# Altium project PCB_Project.PrjPcb (part 1 of 2)
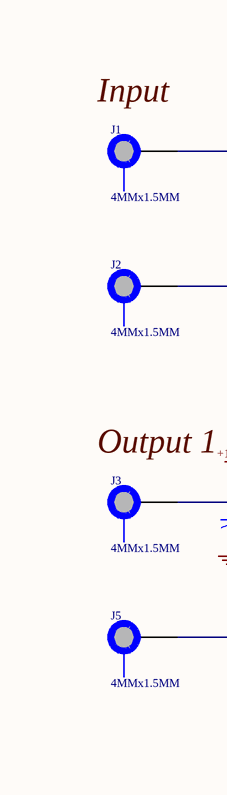
[diagram p0: ISL6236A_DEMO.SchDoc, left]
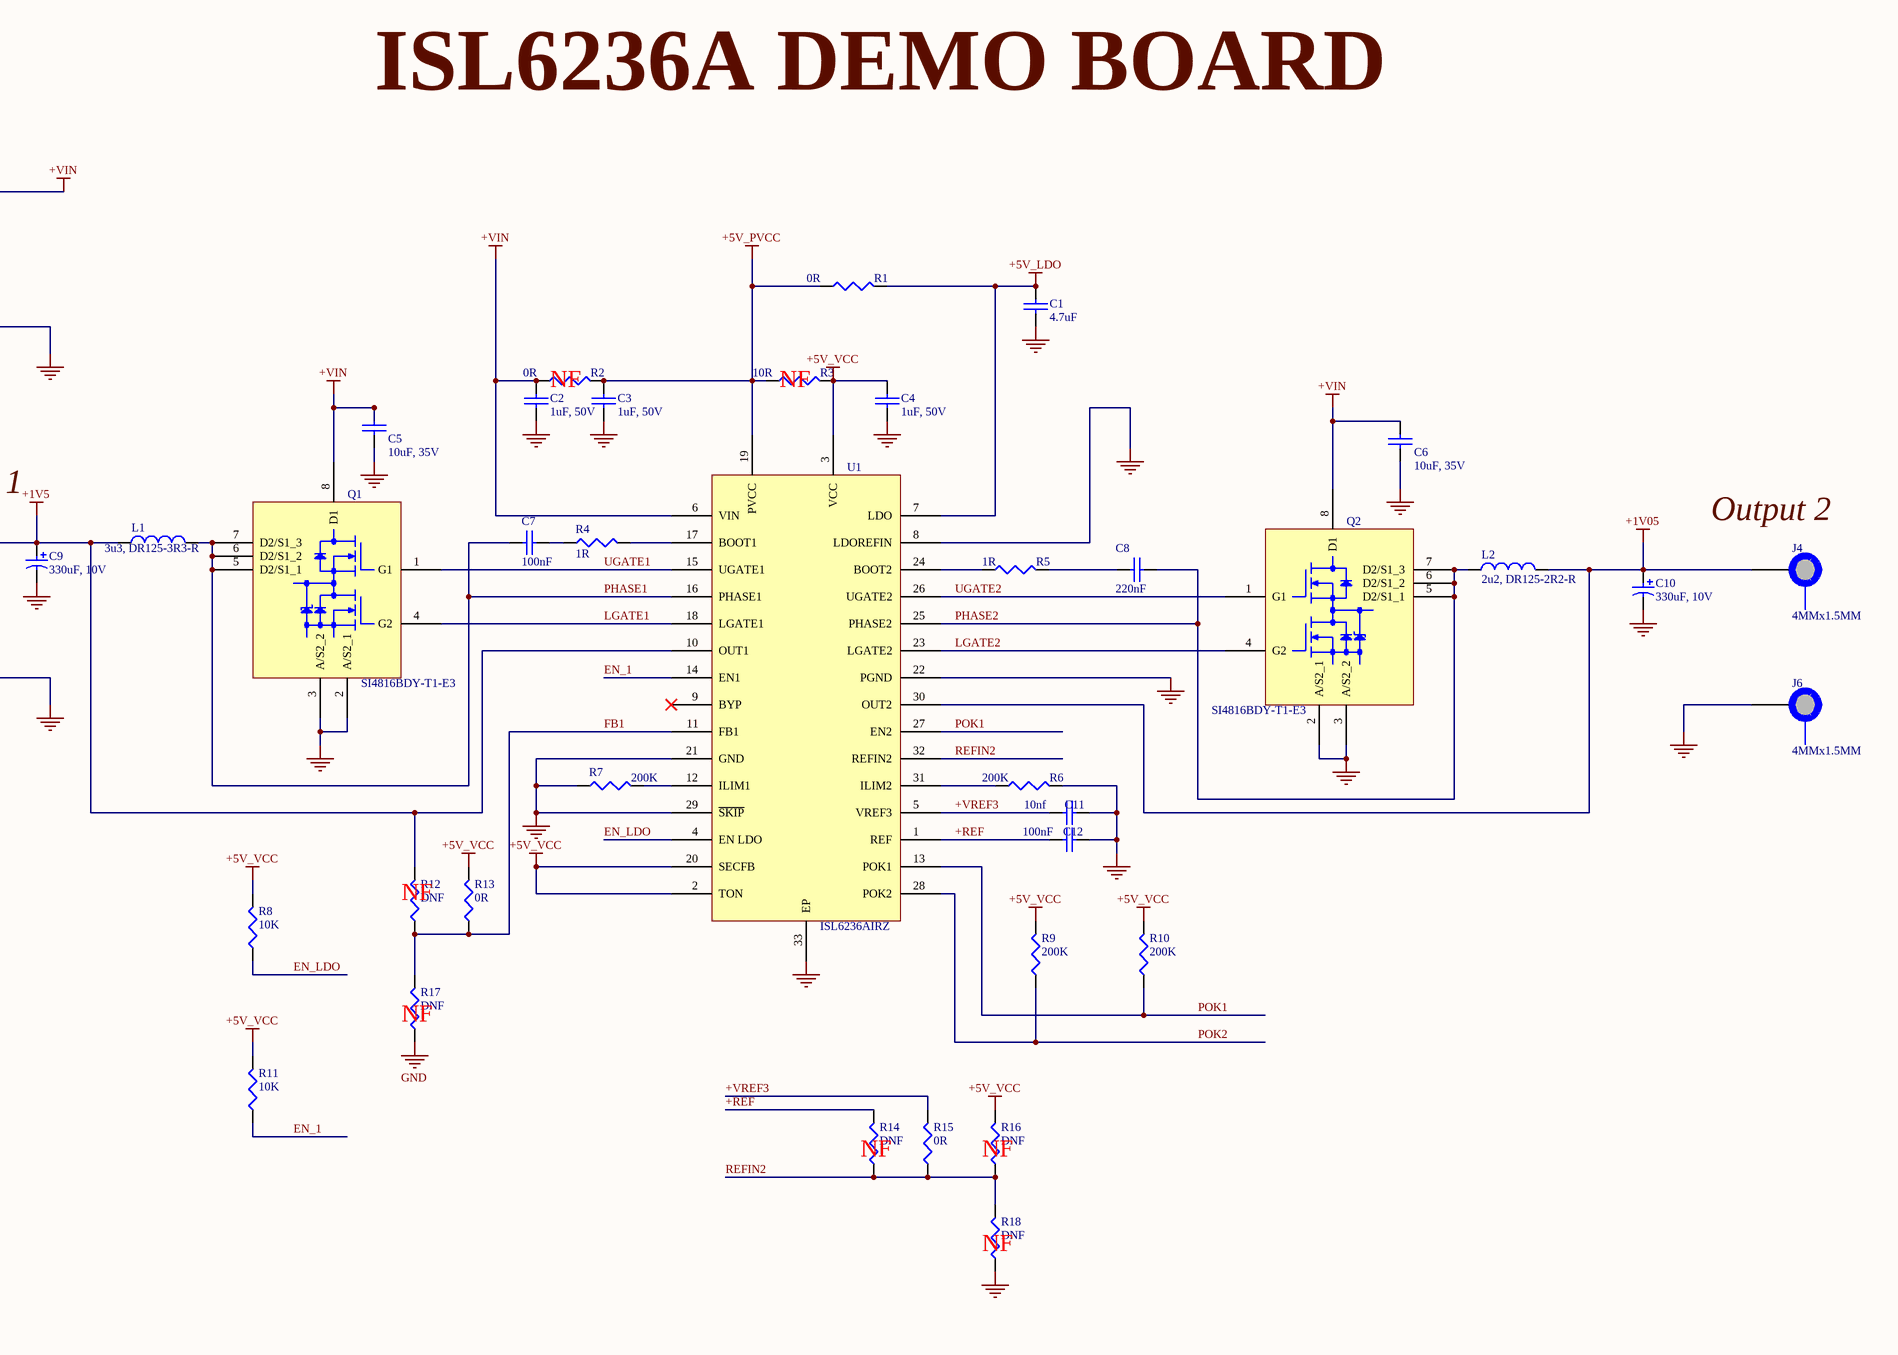
[diagram p1: ISL6236A_DEMO.SchDoc, right]
1 sheet, 41 parts. Net scope: global (net labels, ports and power ports of the same name join across sheets).

## Sheet ISL6236A_DEMO.SchDoc
size A3; SheetNumber: 1; SheetTotal: 1

### Parts
C1  4.7uF
C2  1uF, 50V
C3  1uF, 50V
C4  1uF, 50V
C5  10uF, 35V
C6  10uF, 35V
C7  100nF
C8  220nF
C9  330uF, 10V
C10  330uF, 10V
C11  10nf
C12  100nF
J1  4MMx1.5MM
J2  4MMx1.5MM
J3  4MMx1.5MM
J4  4MMx1.5MM
J5  4MMx1.5MM
J6  4MMx1.5MM
L1  3u3, DR125-3R3-R
L2  2u2, DR125-2R2-R
Q1  SI4816BDY-T1-E3
Q2  SI4816BDY-T1-E3
R1  0R
R2  0R
R3  10R
R4  1R
R5  1R
R6  200K
R7  200K
R8  10K
R9  200K
R10  200K
R11  10K
R12  DNF
R13  0R
R14  DNF
R15  0R
R16  DNF
R17  DNF
R18  DNF
U1  ISL6236AIRZ

### Nets
+1V05: C10.1 J4.1 L2.2 U1.30(OUT2)
+1V5: C9.1 J3.1 L1.1 R12.2 U1.10(OUT1)
+5V_LDO: C1.2 R1.2 U1.7(LDO)
+5V_PVCC: C3.1 R1.1 R2.2 R3.1 U1.19(PVCC)
+5V_VCC: C4.1 R3.2 R8.2 R9.2 R10.2 R11.2 R13.2 R16.2 U1.2(TON) U1.3(VCC) U1.20(SECFB)
+VIN: C2.1 C5.2 C6.2 J1.1 Q1.8(D1) Q2.8(D1) R2.1 U1.6(VIN)
GND: C1.1 C2.2 C3.2 C4.2 C5.1 C6.1 C9.2 C10.2 C11.2 C12.2 J2.1 J5.1 J6.1 Q1.2(A/S2_1) Q1.3(A/S2_2) Q2.2(A/S2_1) Q2.3(A/S2_2) R6.2 R7.1 R17.1 R18.1 U1.8(LDOREFIN) U1.21(GND) U1.22(PGND) U1.29(~{SKIP}) U1.33(EP)
+REF: C12.1 R14.2 U1.1(REF)
+VREF3: C11.1 R15.2 U1.5(VREF3)
EN_1: R11.1 U1.14(EN1)
EN_LDO: R8.1 U1.4(EN_LDO)
FB1: R12.1 R13.1 R17.2 U1.11(FB1)
LGATE1: Q1.4(G2) U1.18(LGATE1)
LGATE2: Q2.4(G2) U1.23(LGATE2)
PHASE1: C7.1 L1.2 Q1.5(D2/S1_1) Q1.6(D2/S1_2) Q1.7(D2/S1_3) U1.16(PHASE1)
PHASE2: C8.2 L2.1 Q2.5(D2/S1_1) Q2.6(D2/S1_2) Q2.7(D2/S1_3) U1.25(PHASE2)
POK1: R10.1 U1.13(POK1) U1.27(EN2)
POK2: R9.1 U1.28(POK2)
REFIN2: R14.1 R15.1 R16.1 R18.2 U1.32(REFIN2)
UGATE1: Q1.1(G1) U1.15(UGATE1)
UGATE2: Q2.1(G1) U1.26(UGATE2)
NetC7_2: C7.2 R4.1
NetC8_1: C8.1 R5.2
NetR4_2: R4.2 U1.17(BOOT1)
NetR5_1: R5.1 U1.24(BOOT2)
NetR6_1: R6.1 U1.31(ILIM2)
NetR7_2: R7.2 U1.12(ILIM1)

Not connected (* = marked no-connect by the designer): U1 9(BYP)*

### Notes on the sheet
- (near J1) Input
- ISL6236A DEMO BOARD
- (near R2) NF
- (near R3) NF
- Output 1
- (near J4) Output 2
- (near R12) NF
- (near R17) NF
- (near R14) NF
- (near R16) NF
- (near R18) NF
### Library data of the parts
C1 = C3216X5R1H475K160AB: C Series 1206 4.7 uF 50 V ±10 % Tolerance X5R SMT Multilayer Ceramic Capacitor; Manufacturer: TDK; Manufacturer Lifecycle Status: PRODUCTION (NOT RECOMMENDED FOR NEW DESIGN); Value: 4.7µF; Tolerance: 10%; Voltage Rating: 50V; Supplier: DigiKey; Supplier Part Number: 445-5994-1-ND; Manufacturer Part Number: C3216X5R1H475K160AB; RoHS: Compliant; Category: Ceramic Capacitors; Stock: 28419; Pricing: 1=0.82, 10=0.514, 50=0.3948, 100=0.358, 500=0.29602, 1000=0.27684 (USD); Case/Package: 1206; Case Code (Imperial): 1206; Case Code (Metric): 3216; China RoHS: Compliant; Composition: Ceramic; Depth: 1.6mm; Dielectric: X5R; Dielectric Material: Ceramic; Export Control Classification Number (ECCN) Code: EAR99; Height: 1.6mm; Harmonized Tariff Schedule (HTS) Code: 8532.24.00.20; Introduction Date: 2012-08-21; Lead Free: Lead Free; Length: 3.2mm; Lifecycle Status: NRND; Material: Ceramic; Max Length: 3.4mm; Max Operating Temperature: 85°C; Max Width: 1.8mm; Min Length: 3mm; Min Operating Temperature: -55°C; Min Width: 1.4mm; Mounting Technology: Surface Mount; Number of Terminals: 2; Packaging: Digi-Reel®; REACH SVHC: Yes; Schedule B: 8532240020, 8532240020|8532240020|8532240020|8532240020|8532240020; Termination: SMD/SMT; Voltage Rating (DC): 50V; Weight: 16.187578mg; Width: 1.6mm; ComponentLink1URL: https://datasheet.octopart.com:443/C3216X5R1H475K160AB-TDK-datasheet-175423548.pdf?src-supplier=IHS; ComponentLink1Description: https://datasheet.octopart.com:443/C3216X5R1H475K160AB-TDK-datasheet-175423548.pdf?src-supplier=IHS; ComponentLink2URL: https://datasheet.octopart.com:443/C3216X5R1H475K160AB-TDK-datasheet-151546523.pdf?src-supplier=TDK; ComponentLink2Description: https://datasheet.octopart.com:443/C3216X5R1H475K160AB-TDK-datasheet-151546523.pdf?src-supplier=TDK; ComponentLink3URL: https://datasheet.octopart.com/C3216X5R1H475K160AB-TDK-datasheet-41194876.pdf; ComponentLink3Description: https://datasheet.octopart.com/C3216X5R1H475K160AB-TDK-datasheet-41194876.pdf; ComponentLink4URL: https://datasheet.octopart.com:443/C3216X5R1H475K160AB-TDK-datasheet-10921857.pdf?src-supplier=Future+Electronics; ComponentLink4Description: https://datasheet.octopart.com:443/C3216X5R1H475K160AB-TDK-datasheet-10921857.pdf?src-supplier=Future+Electronics
C2-C4 = C2012X7R1H105K125AB: C Series 0805 1 uF 50 V ±10% Tolerance X7R SMT Multilayer Ceramic Capacitor; Manufacturer: TDK; Manufacturer Lifecycle Status: PRODUCTION; Manufacturer Package Identifier: 0805 (2012 metric); Value: 1µF; Supplier: DigiKey; Supplier Part Number: 445-7547-1-ND; Manufacturer Part Number: C2012X7R1H105K125AB; RoHS: Compliant; Category: Ceramic Capacitors; Stock: 33882; Pricing: 1=0.27, 10=0.158, 50=0.1146, 100=0.1011, 500=0.07844, 1000=0.07145 (USD); Case/Package: 0805; Case Code (Imperial): 0805; Case Code (Metric): 2012; China RoHS: Compliant; Composition: Ceramic; Depth: 1.25mm; Dielectric: X7R; Dielectric Material: Ceramic; Height: 1.25mm; Lead Free: Lead Free; Length: 2mm; Lifecycle Status: Production; Material: Ceramic; Max Length: 2.2mm; Max Operating Temperature: 125°C; Max Width: 1.45mm; Min Length: 1.8mm; Min Operating Temperature: -55°C; Min Width: 1.05mm; Mounting Technology: Surface Mount; Pins: 2; Number of Terminals: 2; Radiation Hardening: No; REACH SVHC: Yes; Schedule B: 8532240020, 8532240020|8532240020|8532240020|8532240020|8532240020; Termination: SMD/SMT; Tolerance: 10%; Voltage Rating: 50V; Voltage Rating (DC): 50V; Weight: 5.499807mg; Width: 1.25mm; ComponentLink1URL: https://datasheet.octopart.com:443/C2012X7R1H105K125AB-TDK-datasheet-175423548.pdf?src-supplier=TME; ComponentLink1Description: https://datasheet.octopart.com:443/C2012X7R1H105K125AB-TDK-datasheet-175423548.pdf?src-supplier=TME; ComponentLink2URL: https://datasheet.octopart.com:443/C2012X7R1H105K125AB-TDK-datasheet-182135025.pdf?src-supplier=TME; ComponentLink2Description: https://datasheet.octopart.com:443/C2012X7R1H105K125AB-TDK-datasheet-182135025.pdf?src-supplier=TME; ComponentLink3URL: https://datasheet.octopart.com:443/C2012X7R1H105K125AB-TDK-datasheet-159617022.pdf?src-supplier=TME; ComponentLink3Description: https://datasheet.octopart.com:443/C2012X7R1H105K125AB-TDK-datasheet-159617022.pdf?src-supplier=TME; ComponentLink4URL: https://datasheet.octopart.com:443/C2012X7R1H105K125AB-TDK-datasheet-151546523.pdf?src-supplier=ODG+(Origin+Data+Global); ComponentLink4Description: https://datasheet.octopart.com:443/C2012X7R1H105K125AB-TDK-datasheet-151546523.pdf?src-supplier=ODG+(Origin+Data+Global); ComponentLink5URL: https://datasheet.octopart.com/C2012X7R1H105K125AB-TDK-datasheet-41194876.pdf; ComponentLink5Description: https://datasheet.octopart.com/C2012X7R1H105K125AB-TDK-datasheet-41194876.pdf; ComponentLink6URL: https://datasheet.octopart.com:443/C2012X7R1H105K125AB-TDK-datasheet-82475248.pdf?src-supplier=Newark; ComponentLink6Description: https://datasheet.octopart.com:443/C2012X7R1H105K125AB-TDK-datasheet-82475248.pdf?src-supplier=Newark; ComponentLink7URL: https://datasheet.octopart.com:443/C2012X7R1H105K125AB-TDK-datasheet-23766614.pdf?src-supplier=Newark; ComponentLink7Description: https://datasheet.octopart.com:443/C2012X7R1H105K125AB-TDK-datasheet-23766614.pdf?src-supplier=Newark; ComponentLink8URL: https://datasheet.octopart.com:443/C2012X7R1H105K125AB-TDK-datasheet-13444418.pdf?src-supplier=Newark; ComponentLink8Description: https://datasheet.octopart.com:443/C2012X7R1H105K125AB-TDK-datasheet-13444418.pdf?src-supplier=Newark; ComponentLink9URL: https://datasheet.octopart.com:443/C2012X7R1H105K125AB-TDK-datasheet-13376850.pdf?src-supplier=Newark; ComponentLink9Description: https://datasheet.octopart.com:443/C2012X7R1H105K125AB-TDK-datasheet-13376850.pdf?src-supplier=Newark; ComponentLink10URL: https://datasheet.octopart.com:443/C2012X7R1H105K125AB-TDK-datasheet-10978788.pdf?src-supplier=Newark; ComponentLink10Description: https://datasheet.octopart.com:443/C2012X7R1H105K125AB-TDK-datasheet-10978788.pdf?src-supplier=Newark; ComponentLink11URL: https://datasheet.octopart.com:443/C2012X7R1H105K125AB-TDK-datasheet-43729314.pdf?src-supplier=Electro+Sonic; ComponentLink11Description: https://datasheet.octopart.com:443/C2012X7R1H105K125AB-TDK-datasheet-43729314.pdf?src-supplier=Electro+Sonic; ComponentLink12URL: https://datasheet.octopart.com:443/C2012X7R1H105K125AB-TDK-datasheet-10921857.pdf?src-supplier=Future+Electronics; ComponentLink12Description: https://datasheet.octopart.com:443/C2012X7R1H105K125AB-TDK-datasheet-10921857.pdf?src-supplier=Future+Electronics
C5 C6 = C1210C106K6PAC7210: Ceramic Capacitor, Multilayer, Ceramic, 35V, 10% +Tol, 10% -Tol, X5R, 15% TC, 10uF, Surface Mount, 1210; Manufacturer: Yageo Group; Value: 10µF; Supplier: DigiKey; Supplier Part Number: 399-C1210C106K6PAC7210CT-ND; Manufacturer Part Number: C1210C106K6PAC7210; RoHS: Compliant; Category: Ceramic Capacitors; Stock: 7885; Pricing: 1=0.82, 10=0.514, 50=0.3946, 100=0.3578, 500=0.29584, 1000=0.27668 (USD); Case/Package: 1210; China RoHS: Compliant; Country of Origin: Mexico; Dielectric: X5R; Dielectric Material: Ceramic; Export Control Classification Number (ECCN) Code: EAR99; Height: 1.9mm; Harmonized Tariff Schedule (HTS) Code: 8532.24.00.20; Introduction Date: 2016-03-30; Lead Free: Lead Free; Length: 3.2mm; Lifecycle Status: Production; Max Operating Temperature: 85°C; Min Operating Temperature: -55°C; Mounting Technology: Surface Mount; Number of Terminals: 2; REACH SVHC: Yes; Tolerance: 10%; Voltage Rating (DC): 35V; Width: 2.5mm; ComponentLink1URL: https://datasheet.octopart.com:443/C1210C106K6PAC7210-KEMET-datasheet-178499189.pdf?src-supplier=IHS; ComponentLink1Description: https://datasheet.octopart.com:443/C1210C106K6PAC7210-KEMET-datasheet-178499189.pdf?src-supplier=IHS; ComponentLink2URL: https://datasheet.octopart.com/C1210C106K6PAC7210-KEMET-datasheet-84169754.pdf; ComponentLink2Description: https://datasheet.octopart.com/C1210C106K6PAC7210-KEMET-datasheet-84169754.pdf
C7 C12 = C0805X104K5RACTU: Cap Ceramic 0.1uF 50V X7R 10% Pad SMD 0805 Flexible Termination 125C Automotive Medical T/R; Manufacturer: Yageo Group; Manufacturer Package Identifier: 0805 (2012 metric); Dissipation Factor: 2.5%; Supplier: DigiKey; Supplier Part Number: 399-C0805X104K5RACTUCT-ND; Manufacturer Part Number: C0805X104K5RACTU; RoHS: Compliant; Category: Ceramic Capacitors; Stock: 78001; Pricing: 1=0.37, 10=0.223, 50=0.1638, 100=0.1456, 500=0.11516, 1000=0.10575 (USD); Value: 100nF; Case/Package: 0805; Case Code (Imperial): 0805; Case Code (Metric): 2012; China RoHS: Compliant; Depth: 1.25mm; Dielectric: X7R; Dielectric Material: Ceramic; Export Control Classification Number (ECCN) Code: EAR99; Features: Soft Termination; Height: 780µm; Harmonized Tariff Schedule (HTS) Code: 8532.24.00.20; Introduction Date: 2016-01-11; Length: 2mm; Lifecycle Status: Production; Max Operating Temperature: 125°C; Min Operating Temperature: -55°C; Mounting Technology: Surface Mount; Pins: 2; Number of Terminals: 2; Packaging: Cut Tape; REACH SVHC: Yes; Schedule B: 8532240020, 8532240020|8532240020, 8532240020|8532240020|8532240020, 8532240020|8532240020|8532240020|8532240020; Termination: SMD/SMT; Thickness: 889µm; Tolerance: 10%; Voltage Rating: 50V; Voltage Rating (AC): 50V; Voltage Rating (DC): 50V; Width: 1.25mm; ComponentLink1URL: https://datasheet.octopart.com:443/C0805X104K5RACTU-KEMET-datasheet-182040354.pdf?src-supplier=IHS; ComponentLink1Description: https://datasheet.octopart.com:443/C0805X104K5RACTU-KEMET-datasheet-182040354.pdf?src-supplier=IHS; ComponentLink2URL: https://datasheet.octopart.com:443/C0805X104K5RACTU-Kemet-datasheet-498967.pdf?src-supplier=Newark; ComponentLink2Description: https://datasheet.octopart.com:443/C0805X104K5RACTU-Kemet-datasheet-498967.pdf?src-supplier=Newark; ComponentLink3URL: https://datasheet.octopart.com:443/C0805X104K5RACTU-Kemet-datasheet-8764837.pdf?src-supplier=Newark; ComponentLink3Description: https://datasheet.octopart.com:443/C0805X104K5RACTU-Kemet-datasheet-8764837.pdf?src-supplier=Newark; ComponentLink4URL: https://datasheet.octopart.com:443/C0805X104K5RACTU-Kemet-datasheet-8480123.pdf?src-supplier=Newark; ComponentLink4Description: https://datasheet.octopart.com:443/C0805X104K5RACTU-Kemet-datasheet-8480123.pdf?src-supplier=Newark; ComponentLink5URL: https://datasheet.octopart.com:443/C0805X104K5RACTU-Kemet-datasheet-5313890.pdf?src-supplier=Newark; ComponentLink5Description: https://datasheet.octopart.com:443/C0805X104K5RACTU-Kemet-datasheet-5313890.pdf?src-supplier=Newark; ComponentLink6URL: https://datasheet.octopart.com:443/C0805X104K5RACTU-Kemet-datasheet-5390537.pdf?src-supplier=Newark; ComponentLink6Description: https://datasheet.octopart.com:443/C0805X104K5RACTU-Kemet-datasheet-5390537.pdf?src-supplier=Newark; ComponentLink7URL: https://datasheet.octopart.com:443/C0805X104K5RACTU-Kemet-datasheet-5393970.pdf?src-supplier=Newark; ComponentLink7Description: https://datasheet.octopart.com:443/C0805X104K5RACTU-Kemet-datasheet-5393970.pdf?src-supplier=Newark; ComponentLink8URL: https://datasheet.octopart.com:443/C0805X104K5RACTU-Kemet-datasheet-8502025.pdf?src-supplier=Newark; ComponentLink8Description: https://datasheet.octopart.com:443/C0805X104K5RACTU-Kemet-datasheet-8502025.pdf?src-supplier=Newark; ComponentLink9URL: https://datasheet.octopart.com:443/C0805X104K5RACTU-Kemet-datasheet-7541751.pdf?src-supplier=Newark; ComponentLink9Description: https://datasheet.octopart.com:443/C0805X104K5RACTU-Kemet-datasheet-7541751.pdf?src-supplier=Newark; ComponentLink10URL: https://datasheet.octopart.com:443/C0805X104K5RACTU-Kemet-datasheet-161801.pdf?src-supplier=Newark; ComponentLink10Description: https://datasheet.octopart.com:443/C0805X104K5RACTU-Kemet-datasheet-161801.pdf?src-supplier=Newark; ComponentLink11URL: https://datasheet.octopart.com:443/C0805X104K5RACTU-KEMET-datasheet-176142390.pdf?src-supplier=Newark; ComponentLink11Description: https://datasheet.octopart.com:443/C0805X104K5RACTU-KEMET-datasheet-176142390.pdf?src-supplier=Newark; ComponentLink12URL: https://datasheet.octopart.com:443/C0805X104K5RACTU-KEMET-datasheet-181958278.pdf?src-supplier=Farnell; ComponentLink12Description: https://datasheet.octopart.com:443/C0805X104K5RACTU-KEMET-datasheet-181958278.pdf?src-supplier=Farnell; ComponentLink13URL: https://datasheet.octopart.com:443/C0805X104K5RACTU-KEMET-datasheet-181958277.pdf?src-supplier=Farnell; ComponentLink13Description: https://datasheet.octopart.com:443/C0805X104K5RACTU-KEMET-datasheet-181958277.pdf?src-supplier=Farnell; ComponentLink14URL: https://datasheet.octopart.com:443/C0805X104K5RACTU-KEMET-datasheet-101576457.pdf?src-supplier=Farnell; ComponentLink14Description: https://datasheet.octopart.com:443/C0805X104K5RACTU-KEMET-datasheet-101576457.pdf?src-supplier=Farnell; ComponentLink15URL: https://datasheet.octopart.com:443/C0805X104K5RACTU-KEMET-datasheet-175423158.pdf?src-supplier=Farnell; ComponentLink15Description: https://datasheet.octopart.com:443/C0805X104K5RACTU-KEMET-datasheet-175423158.pdf?src-supplier=Farnell; ComponentLink16URL: https://datasheet.octopart.com:443/C0805X104K5RACTU-Kemet-datasheet-66093367.pdf?src-supplier=element14+APAC; ComponentLink16Description: https://datasheet.octopart.com:443/C0805X104K5RACTU-Kemet-datasheet-66093367.pdf?src-supplier=element14+APAC; ComponentLink17URL: https://datasheet.octopart.com:443/C0805X104K5RACTU-KEMET-datasheet-81638493.pdf?src-supplier=element14+APAC; ComponentLink17Description: https://datasheet.octopart.com:443/C0805X104K5RACTU-KEMET-datasheet-81638493.pdf?src-supplier=element14+APAC; ComponentLink18URL: https://datasheet.octopart.com:443/C0805X104K5RACTU-Kemet-datasheet-67167355.pdf?src-supplier=element14+APAC; ComponentLink18Description: https://datasheet.octopart.com:443/C0805X104K5RACTU-Kemet-datasheet-67167355.pdf?src-supplier=element14+APAC; ComponentLink19URL: https://datasheet.octopart.com:443/C0805X104K5RACTU-KEMET-datasheet-192294609.pdf?src-supplier=element14+APAC; ComponentLink19Description: https://datasheet.octopart.com:443/C0805X104K5RACTU-KEMET-datasheet-192294609.pdf?src-supplier=element14+APAC; ComponentLink20URL: https://datasheet.octopart.com:443/C0805X104K5RACTU-KEMET-datasheet-142166354.pdf?src-supplier=Electro+Sonic; ComponentLink20Description: https://datasheet.octopart.com:443/C0805X104K5RACTU-KEMET-datasheet-142166354.pdf?src-supplier=Electro+Sonic; ComponentLink21URL: https://datasheet.octopart.com:443/C0805X104K5RACTU-KEMET-datasheet-68331963.pdf?src-supplier=TME; ComponentLink21Description: https://datasheet.octopart.com:443/C0805X104K5RACTU-KEMET-datasheet-68331963.pdf?src-supplier=TME; ComponentLink22URL: https://datasheet.octopart.com:443/C0805X104K5RACTU-KEMET-datasheet-68322508.pdf?src-supplier=TME; ComponentLink22Description: https://datasheet.octopart.com:443/C0805X104K5RACTU-KEMET-datasheet-68322508.pdf?src-supplier=TME; ComponentLink23URL: https://datasheet.octopart.com/C0805X104K5RACTU-KEMET-datasheet-84169754.pdf; ComponentLink23Description: https://datasheet.octopart.com/C0805X104K5RACTU-KEMET-datasheet-84169754.pdf; ComponentLink24URL: https://datasheet.octopart.com:443/C0805X104K5RACTU-Kemet-datasheet-8837965.pdf?src-supplier=element14; ComponentLink24Description: https://datasheet.octopart.com:443/C0805X104K5RACTU-Kemet-datasheet-8837965.pdf?src-supplier=element14
C8 = C0805C224K5RACTU: 50V 220nF X7R ±10% 0805 Multilayer Ceramic Capacitors MLCC - SMD/SMT ROHS; Manufacturer: Yageo Group; Dissipation Factor: 2.5%; Temperature Coefficient: 30ppm/°C; Supplier: DigiKey; Supplier Part Number: 399-C0805C224K5RACTUCT-ND; Manufacturer Part Number: C0805C224K5RACTU; RoHS: Compliant; Category: Ceramic Capacitors; Stock: 396277; Pricing: 1=0.22, 10=0.127, 50=0.0906, 100=0.0795, 500=0.06094, 1000=0.05521 (USD); Value: 220nF; Case/Package: 0805; Case Code (Imperial): 0805; China RoHS: Compliant; Country of Origin: Mainland China, Taiwan; Depth: 1.25mm; Dielectric: X7R; Dielectric Material: Ceramic; Export Control Classification Number (ECCN) Code: EAR99; Height: 1.25mm; Harmonized Tariff Schedule (HTS) Code: 8532.24.00.20; Introduction Date: 2011-08-12; Lead Free: Lead Free; Lead Pitch: 750µm; Length: 2mm; Lifecycle Status: Production; Material: Ceramic; Max Operating Temperature: 125°C; Min Operating Temperature: -55°C; Mounting Technology: Surface Mount; Pins: 2; Number of Terminals: 2; Packaging: Cut Tape; Radiation Hardening: No; REACH SVHC: Yes; Schedule B: 8532240020, 8532240020|8532240020, 8532240020|8532240020|8532240020, 8532240020|8532240020|8532240020|8532240020; Termination: SMD/SMT; Thickness: 1.397mm; Tolerance: 10%; Voltage: 50V; Voltage Rating: 50V; Voltage Rating (DC): 50V; Width: 1.25mm; ComponentLink1URL: https://datasheet.octopart.com:443/C0805C224K5RACTU-KEMET-datasheet-178445679.pdf?src-supplier=IHS; ComponentLink1Description: https://datasheet.octopart.com:443/C0805C224K5RACTU-KEMET-datasheet-178445679.pdf?src-supplier=IHS; ComponentLink2URL: https://datasheet.octopart.com:443/C0805C224K5RAC7800-KEMET-datasheet-184793319.pdf?src-supplier=IHS; ComponentLink2Description: https://datasheet.octopart.com:443/C0805C224K5RAC7800-KEMET-datasheet-184793319.pdf?src-supplier=IHS; ComponentLink3URL: https://datasheet.octopart.com:443/C0805C224K5RACTU-Kemet-datasheet-5313890.pdf?src-supplier=Upverter; ComponentLink3Description: https://datasheet.octopart.com:443/C0805C224K5RACTU-Kemet-datasheet-5313890.pdf?src-supplier=Upverter; ComponentLink4URL: https://datasheet.octopart.com:443/C0805C224K5RACTU-KEMET-datasheet-68331921.pdf?src-supplier=Upverter; ComponentLink4Description: https://datasheet.octopart.com:443/C0805C224K5RACTU-KEMET-datasheet-68331921.pdf?src-supplier=Upverter; ComponentLink5URL: https://datasheet.octopart.com:443/C0805C224K5RACTU-KEMET-datasheet-137357759.pdf?src-supplier=Farnell; ComponentLink5Description: https://datasheet.octopart.com:443/C0805C224K5RACTU-KEMET-datasheet-137357759.pdf?src-supplier=Farnell; ComponentLink6URL: https://datasheet.octopart.com:443/C0805C224K5RACTU-Kemet-datasheet-12608295.pdf?src-supplier=Farnell; ComponentLink6Description: https://datasheet.octopart.com:443/C0805C224K5RACTU-Kemet-datasheet-12608295.pdf?src-supplier=Farnell; ComponentLink7URL: https://datasheet.octopart.com:443/C0805C224K5RACTU-Kemet-datasheet-11992184.pdf?src-supplier=Farnell; ComponentLink7Description: https://datasheet.octopart.com:443/C0805C224K5RACTU-Kemet-datasheet-11992184.pdf?src-supplier=Farnell; ComponentLink8URL: https://datasheet.octopart.com:443/C0805C224K5RACTU-Kemet-datasheet-10942409.pdf?src-supplier=Farnell; ComponentLink8Description: https://datasheet.octopart.com:443/C0805C224K5RACTU-Kemet-datasheet-10942409.pdf?src-supplier=Farnell; ComponentLink9URL: https://datasheet.octopart.com:443/C0805C224K5RACTU-Kemet-datasheet-10404442.pdf?src-supplier=Farnell; ComponentLink9Description: https://datasheet.octopart.com:443/C0805C224K5RACTU-Kemet-datasheet-10404442.pdf?src-supplier=Farnell; ComponentLink10URL: https://datasheet.octopart.com:443/C0805C224K5RACTU-KEMET-datasheet-101576247.pdf?src-supplier=Farnell; ComponentLink10Description: https://datasheet.octopart.com:443/C0805C224K5RACTU-KEMET-datasheet-101576247.pdf?src-supplier=Farnell; ComponentLink11URL: https://datasheet.octopart.com:443/C0805C224K5RACTU-KEMET-datasheet-176142328.pdf?src-supplier=Farnell; ComponentLink11Description: https://datasheet.octopart.com:443/C0805C224K5RACTU-KEMET-datasheet-176142328.pdf?src-supplier=Farnell; ComponentLink12URL: https://datasheet.octopart.com:443/C0805C224K5RACTU-Kemet-datasheet-503297.pdf?src-supplier=Farnell; ComponentLink12Description: https://datasheet.octopart.com:443/C0805C224K5RACTU-Kemet-datasheet-503297.pdf?src-supplier=Farnell; ComponentLink13URL: https://datasheet.octopart.com:443/C0805C224K5RACTU-KEMET-datasheet-32036385.pdf?src-supplier=Electro+Sonic; ComponentLink13Description: https://datasheet.octopart.com:443/C0805C224K5RACTU-KEMET-datasheet-32036385.pdf?src-supplier=Electro+Sonic; ComponentLink14URL: https://datasheet.octopart.com:443/C0805C224K5RACTU-KEMET-datasheet-176289652.pdf?src-supplier=Newark; ComponentLink14Description: https://datasheet.octopart.com:443/C0805C224K5RACTU-KEMET-datasheet-176289652.pdf?src-supplier=Newark; ComponentLink15URL: https://datasheet.octopart.com:443/C0805C224K5RACTU-KEMET-datasheet-130256537.pdf?src-supplier=Newark; ComponentLink15Description: https://datasheet.octopart.com:443/C0805C224K5RACTU-KEMET-datasheet-130256537.pdf?src-supplier=Newark; ComponentLink16URL: https://datasheet.octopart.com:443/C0805C224K5RACTU-Kemet-datasheet-8764837.pdf?src-supplier=Newark; ComponentLink16Description: https://datasheet.octopart.com:443/C0805C224K5RACTU-Kemet-datasheet-8764837.pdf?src-supplier=Newark; ComponentLink17URL: https://datasheet.octopart.com:443/C0805C224K5RACTU-Kemet-datasheet-8480123.pdf?src-supplier=Newark; ComponentLink17Description: https://datasheet.octopart.com:443/C0805C224K5RACTU-Kemet-datasheet-8480123.pdf?src-supplier=Newark; ComponentLink18URL: https://datasheet.octopart.com:443/C0805C224K5RACTU-Kemet-datasheet-5390537.pdf?src-supplier=Newark; ComponentLink18Description: https://datasheet.octopart.com:443/C0805C224K5RACTU-Kemet-datasheet-5390537.pdf?src-supplier=Newark; ComponentLink19URL: https://datasheet.octopart.com:443/C0805C224K5RACTU-Kemet-datasheet-5393970.pdf?src-supplier=Newark; ComponentLink19Description: https://datasheet.octopart.com:443/C0805C224K5RACTU-Kemet-datasheet-5393970.pdf?src-supplier=Newark; ComponentLink20URL: https://datasheet.octopart.com:443/C0805C224K5RACTU-Kemet-datasheet-8502025.pdf?src-supplier=Newark; ComponentLink20Description: https://datasheet.octopart.com:443/C0805C224K5RACTU-Kemet-datasheet-8502025.pdf?src-supplier=Newark; ComponentLink21URL: https://datasheet.octopart.com:443/C0805C224K5RACTU-Kemet-datasheet-7541751.pdf?src-supplier=Newark; ComponentLink21Description: https://datasheet.octopart.com:443/C0805C224K5RACTU-Kemet-datasheet-7541751.pdf?src-supplier=Newark; ComponentLink22URL: https://datasheet.octopart.com:443/C0805C224K5RACTU-Kemet-datasheet-161801.pdf?src-supplier=Newark; ComponentLink22Description: https://datasheet.octopart.com:443/C0805C224K5RACTU-Kemet-datasheet-161801.pdf?src-supplier=Newark; ComponentLink23URL: https://datasheet.octopart.com:443/C0805C224K5RACTU-KEMET-datasheet-164512540.pdf?src-supplier=TME; ComponentLink23Description: https://datasheet.octopart.com:443/C0805C224K5RACTU-KEMET-datasheet-164512540.pdf?src-supplier=TME; ComponentLink24URL: https://datasheet.octopart.com:443/C0805C224K5RACTU-KEMET-datasheet-68299312.pdf?src-supplier=TME; ComponentLink24Description: https://datasheet.octopart.com:443/C0805C224K5RACTU-KEMET-datasheet-68299312.pdf?src-supplier=TME; ComponentLink25URL: https://datasheet.octopart.com:443/C0805C224K5RACTU-KEMET-datasheet-68331906.pdf?src-supplier=TME; ComponentLink25Description: https://datasheet.octopart.com:443/C0805C224K5RACTU-KEMET-datasheet-68331906.pdf?src-supplier=TME; ComponentLink26URL: https://datasheet.octopart.com:443/C0805C224K5RAC7800-Kemet-datasheet-62098571.pdf?src-supplier=TME; ComponentLink26Description: https://datasheet.octopart.com:443/C0805C224K5RAC7800-Kemet-datasheet-62098571.pdf?src-supplier=TME; ComponentLink27URL: https://datasheet.octopart.com:443/C0805C224K5RAC7800-Kemet-datasheet-17577222.pdf?src-supplier=TME; ComponentLink27Description: https://datasheet.octopart.com:443/C0805C224K5RAC7800-Kemet-datasheet-17577222.pdf?src-supplier=TME; ComponentLink28URL: https://datasheet.octopart.com:443/C0805C224K5RACTU-KEMET-datasheet-110724412.pdf?src-supplier=RS+(Formerly+Allied+Electronics); ComponentLink28Description: https://datasheet.octopart.com:443/C0805C224K5RACTU-KEMET-datasheet-110724412.pdf?src-supplier=RS+(Formerly+Allied+Electronics); ComponentLink29URL: https://datasheet.octopart.com:443/C0805C224K5RACTU-Kemet-datasheet-464.pdf?src-supplier=RS+(Formerly+Allied+Electronics); ComponentLink29Description: https://datasheet.octopart.com:443/C0805C224K5RACTU-Kemet-datasheet-464.pdf?src-supplier=RS+(Formerly+Allied+Electronics); ComponentLink30URL: https://datasheet.octopart.com/C0805C224K5RACTU-KEMET-datasheet-84169754.pdf; ComponentLink30Description: https://datasheet.octopart.com/C0805C224K5RACTU-KEMET-datasheet-84169754.pdf; ComponentLink31URL: https://datasheet.octopart.com:443/C0805C224K5RACTU-Kemet-datasheet-22084244.pdf?src-supplier=element14+APAC; ComponentLink31Description: https://datasheet.octopart.com:443/C0805C224K5RACTU-Kemet-datasheet-22084244.pdf?src-supplier=element14+APAC; ComponentLink32URL: https://datasheet.octopart.com:443/C0805C224K5RACTU-Kemet-datasheet-11546808.pdf?src-supplier=Arrow+Electronics; ComponentLink32Description: https://datasheet.octopart.com:443/C0805C224K5RACTU-Kemet-datasheet-11546808.pdf?src-supplier=Arrow+Electronics; ComponentLink33URL: https://datasheet.octopart.com:443/C0805C224K5RAC7800-KEMET-datasheet-164857143.pdf?src-supplier=Burklin+Elektronik; ComponentLink33Description: https://datasheet.octopart.com:443/C0805C224K5RAC7800-KEMET-datasheet-164857143.pdf?src-supplier=Burklin+Elektronik; ComponentLink34URL: http://sigma.octopart.com:80/conflict_mineral_statement/Yageo-company-3.pdf?src-supplier=Compliance+Statements; ComponentLink34Description: http://sigma.octopart.com:80/conflict_mineral_statement/Yageo-company-3.pdf?src-supplier=Compliance+Statements; ComponentLink35URL: http://sigma.octopart.com:80/rohs_statement/Yageo-company-2.pdf?src-supplier=Compliance+Statements; ComponentLink35Description: http://sigma.octopart.com:80/rohs_statement/Yageo-company-2.pdf?src-supplier=Compliance+Statements
C9 C10 = T530X337M010ATE004: Cap Tant Solid 330uF 10V X CASE 20% (7.3 X 4.3 X 4mm) SMD 7343-43 T/R; Manufacturer: Yageo Group; Value: 330µF; Dissipation Factor: 8%; ESR (Equivalent Series Resistance): 4mΩ; Leakage Current: 330µA; Life (Hours): 2000hours; Polarity: Polar; Ripple Current: 2.05A; Supplier: DigiKey; Supplier Part Number: 399-10378-1-ND; Manufacturer Part Number: T530X337M010ATE004; RoHS: Compliant; Category: Tantalum Capacitors; Stock: 14063; Pricing: 1=9.26, 10=6.976, 50=6.0632, 100=5.7807 (USD); Case/Package: 2917; Case Code (Imperial): 2917; Case Code (Metric): 7343; China RoHS: Compliant; Depth: 4.3mm; Features: General Purpose; Height: 4mm; Height - Seated (Max): 4.2926mm; Length: 7.3mm; Lifecycle Status: Production; Max Operating Temperature: 125°C; Min Operating Temperature: -55°C; Mounting Technology: Surface Mount; Number of Terminals: 2; Packaging: Cut Tape; REACH SVHC: Yes; Schedule B: 8532210050, 8532210050|8532210050|8532210050|8532210050|8532210050; Termination: SMD/SMT; Tolerance: 20%; Voltage: 10V; Voltage Rating: 10V; Voltage Rating (DC): 10V; Width: 4.3mm; ComponentLink1URL: https://datasheet.octopart.com:443/T530X337M010ATE004-KEMET-datasheet-182062996.pdf?src-supplier=IHS; ComponentLink1Description: https://datasheet.octopart.com:443/T530X337M010ATE004-KEMET-datasheet-182062996.pdf?src-supplier=IHS; ComponentLink2URL: https://datasheet.octopart.com:443/T530X337M010ATE004-KEMET-datasheet-137404858.pdf?src-supplier=Upverter; ComponentLink2Description: https://datasheet.octopart.com:443/T530X337M010ATE004-KEMET-datasheet-137404858.pdf?src-supplier=Upverter; ComponentLink3URL: https://datasheet.octopart.com:443/T530X337M010ATE004-KEMET-datasheet-140124355.pdf?src-supplier=Farnell; ComponentLink3Description: https://datasheet.octopart.com:443/T530X337M010ATE004-KEMET-datasheet-140124355.pdf?src-supplier=Farnell; ComponentLink4URL: https://datasheet.octopart.com:443/T530X337M010ATE004-KEMET-datasheet-101579198.pdf?src-supplier=Farnell; ComponentLink4Description: https://datasheet.octopart.com:443/T530X337M010ATE004-KEMET-datasheet-101579198.pdf?src-supplier=Farnell; ComponentLink5URL: https://datasheet.octopart.com:443/T530X337M010ATE004-KEMET-datasheet-182017436.pdf?src-supplier=Farnell; ComponentLink5Description: https://datasheet.octopart.com:443/T530X337M010ATE004-KEMET-datasheet-182017436.pdf?src-supplier=Farnell; ComponentLink6URL: https://datasheet.octopart.com:443/T530X337M010ATE004-Kemet-datasheet-26568957.pdf?src-supplier=Newark; ComponentLink6Description: https://datasheet.octopart.com:443/T530X337M010ATE004-Kemet-datasheet-26568957.pdf?src-supplier=Newark; ComponentLink7URL: https://datasheet.octopart.com:443/T530X337M010ATE004-KEMET-datasheet-81638763.pdf?src-supplier=Newark; ComponentLink7Description: https://datasheet.octopart.com:443/T530X337M010ATE004-KEMET-datasheet-81638763.pdf?src-supplier=Newark; ComponentLink8URL: https://datasheet.octopart.com:443/T530X337M010ATE004-KEMET-datasheet-166081189.pdf?src-supplier=Newark; ComponentLink8Description: https://datasheet.octopart.com:443/T530X337M010ATE004-KEMET-datasheet-166081189.pdf?src-supplier=Newark; ComponentLink9URL: https://datasheet.octopart.com:443/T530X337M010ATE004-Kemet-datasheet-66325550.pdf?src-supplier=Newark; ComponentLink9Description: https://datasheet.octopart.com:443/T530X337M010ATE004-Kemet-datasheet-66325550.pdf?src-supplier=Newark; ComponentLink10URL: https://datasheet.octopart.com:443/T530X337M010ATE004-KEMET-datasheet-193588003.pdf?src-supplier=Newark; ComponentLink10Description: https://datasheet.octopart.com:443/T530X337M010ATE004-KEMET-datasheet-193588003.pdf?src-supplier=Newark; ComponentLink11URL: https://datasheet.octopart.com:443/T530X337M010ATE004-Kemet-datasheet-66533080.pdf?src-supplier=element14+APAC; ComponentLink11Description: https://datasheet.octopart.com:443/T530X337M010ATE004-Kemet-datasheet-66533080.pdf?src-supplier=element14+APAC; ComponentLink12URL: https://datasheet.octopart.com:443/T530X337M010ATE004-KEMET-datasheet-83562318.pdf?src-supplier=element14+APAC; ComponentLink12Description: https://datasheet.octopart.com:443/T530X337M010ATE004-KEMET-datasheet-83562318.pdf?src-supplier=element14+APAC; ComponentLink13URL: https://datasheet.octopart.com:443/T530X337M010ATE004-KEMET-datasheet-98355851.pdf?src-supplier=TME; ComponentLink13Description: https://datasheet.octopart.com:443/T530X337M010ATE004-KEMET-datasheet-98355851.pdf?src-supplier=TME; ComponentLink14URL: https://datasheet.octopart.com:443/T530X337M010ATE004-KEMET-datasheet-67697638.pdf?src-supplier=TME; ComponentLink14Description: https://datasheet.octopart.com:443/T530X337M010ATE004-KEMET-datasheet-67697638.pdf?src-supplier=TME; ComponentLink15URL: https://datasheet.octopart.com:443/T530X337M010ATE004-Kemet-datasheet-11837805.pdf?src-supplier=Arrow+Electronics; ComponentLink15Description: https://datasheet.octopart.com:443/T530X337M010ATE004-Kemet-datasheet-11837805.pdf?src-supplier=Arrow+Electronics; ComponentLink16URL: https://datasheet.octopart.com:443/T530X337M010ATE004-Kemet-datasheet-8047.pdf?src-supplier=RS+(Formerly+Allied+Electronics); ComponentLink16Description: https://datasheet.octopart.com:443/T530X337M010ATE004-Kemet-datasheet-8047.pdf?src-supplier=RS+(Formerly+Allied+Electronics)
C11 = C0805C103K5RACTU: Multilayer Ceramic Capacitors Mlcc - Smd/Smt 50V 0.01Uf X7R 0805 10%; Manufacturer: Yageo Group; Temperature Coefficient: 30ppm/°C; Supplier: DigiKey; Supplier Part Number: 399-C0805C103K5RACTUCT-ND; Manufacturer Part Number: C0805C103K5RACTU; RoHS: Compliant; Category: Ceramic Capacitors; Stock: 1722319; Pricing: 1=0.11, 10=0.06, 50=0.0416, 100=0.036, 500=0.02644, 1000=0.02351 (USD); Value: 10nF; Case/Package: 0805; Case Code (Imperial): 0805; China RoHS: Compliant; Country of Origin: Mainland China; Depth: 1.25mm; Dielectric: X7R; Dielectric Material: Ceramic; Export Control Classification Number (ECCN) Code: EAR99; Height: 780µm; Harmonized Tariff Schedule (HTS) Code: 8532.24.00.20; Introduction Date: 2012-12-07; Lead Free: Lead Free; Lead Pitch: 750µm; Length: 2mm; Lifecycle Status: Production; Material: Ceramic; Max Operating Temperature: 125°C; Min Operating Temperature: -55°C; Mounting Technology: Surface Mount; Pins: 2; Number of Terminals: 2; Packaging: Cut Tape; Radiation Hardening: No; REACH SVHC: Yes; Schedule B: 8532240020, 8532240020|8532240020|8532240020|8532240020|8532240020, 8532240020|8532240020|8532240020|8532240020|8532240020|8532240020, 8532240020|8532240020|8532240020|8532240020|8532240020|8532240020|8532240020; Termination: SMD/SMT; Thickness: 889µm; Tolerance: 10%; Voltage: 50V; Voltage Rating: 50V; Voltage Rating (AC): 50V; Voltage Rating (DC): 50V; Width: 1.25mm; ComponentLink1URL: https://datasheet.octopart.com:443/C0805C103K5RACTU-KEMET-datasheet-178445679.pdf?src-supplier=Farnell; ComponentLink1Description: https://datasheet.octopart.com:443/C0805C103K5RACTU-KEMET-datasheet-178445679.pdf?src-supplier=Farnell; ComponentLink2URL: https://datasheet.octopart.com:443/C0805C103K5RACTU-KEMET-datasheet-137357759.pdf?src-supplier=Farnell; ComponentLink2Description: https://datasheet.octopart.com:443/C0805C103K5RACTU-KEMET-datasheet-137357759.pdf?src-supplier=Farnell; ComponentLink3URL: https://datasheet.octopart.com:443/C0805C103K5RACTU-KEMET-datasheet-101576077.pdf?src-supplier=Farnell; ComponentLink3Description: https://datasheet.octopart.com:443/C0805C103K5RACTU-KEMET-datasheet-101576077.pdf?src-supplier=Farnell; ComponentLink4URL: https://datasheet.octopart.com:443/C0805C103K5RACTU-KEMET-datasheet-176142291.pdf?src-supplier=Farnell; ComponentLink4Description: https://datasheet.octopart.com:443/C0805C103K5RACTU-KEMET-datasheet-176142291.pdf?src-supplier=Farnell; ComponentLink5URL: https://datasheet.octopart.com:443/C0805C103K5RAC-TU-Kemet-datasheet-7833651.pdf?src-supplier=Farnell; ComponentLink5Description: https://datasheet.octopart.com:443/C0805C103K5RAC-TU-Kemet-datasheet-7833651.pdf?src-supplier=Farnell; ComponentLink6URL: https://datasheet.octopart.com:443/C0805C103K5RAC-TU-Kemet-datasheet-7601896.pdf?src-supplier=Farnell; ComponentLink6Description: https://datasheet.octopart.com:443/C0805C103K5RAC-TU-Kemet-datasheet-7601896.pdf?src-supplier=Farnell; ComponentLink7URL: https://datasheet.octopart.com:443/C0805C103K5RAC-TU-Kemet-datasheet-5316294.pdf?src-supplier=Farnell; ComponentLink7Description: https://datasheet.octopart.com:443/C0805C103K5RAC-TU-Kemet-datasheet-5316294.pdf?src-supplier=Farnell; ComponentLink8URL: https://datasheet.octopart.com:443/C0805C103K5RAC-TU-Kemet-datasheet-5314837.pdf?src-supplier=Farnell; ComponentLink8Description: https://datasheet.octopart.com:443/C0805C103K5RAC-TU-Kemet-datasheet-5314837.pdf?src-supplier=Farnell; ComponentLink9URL: https://datasheet.octopart.com:443/C0805C103K5RAC-TU-Kemet-datasheet-8092359.pdf?src-supplier=Farnell; ComponentLink9Description: https://datasheet.octopart.com:443/C0805C103K5RAC-TU-Kemet-datasheet-8092359.pdf?src-supplier=Farnell; ComponentLink10URL: https://datasheet.octopart.com:443/C0805C103K5RAC-TU-Kemet-datasheet-5314449.pdf?src-supplier=Farnell; ComponentLink10Description: https://datasheet.octopart.com:443/C0805C103K5RAC-TU-Kemet-datasheet-5314449.pdf?src-supplier=Farnell; ComponentLink11URL: https://datasheet.octopart.com:443/C0805C103K5RACTU-Kemet-datasheet-5314969.pdf?src-supplier=Farnell; ComponentLink11Description: https://datasheet.octopart.com:443/C0805C103K5RACTU-Kemet-datasheet-5314969.pdf?src-supplier=Farnell; ComponentLink12URL: https://datasheet.octopart.com:443/C0805C103K5RAC-TU-Kemet-datasheet-5314627.pdf?src-supplier=Farnell; ComponentLink12Description: https://datasheet.octopart.com:443/C0805C103K5RAC-TU-Kemet-datasheet-5314627.pdf?src-supplier=Farnell; ComponentLink13URL: https://datasheet.octopart.com:443/C0805C103K5RAC-TU-Kemet-datasheet-5389132.pdf?src-supplier=Farnell; ComponentLink13Description: https://datasheet.octopart.com:443/C0805C103K5RAC-TU-Kemet-datasheet-5389132.pdf?src-supplier=Farnell; ComponentLink14URL: https://datasheet.octopart.com:443/C0805C103K5RAC-TU-Kemet-datasheet-5313836.pdf?src-supplier=Farnell; ComponentLink14Description: https://datasheet.octopart.com:443/C0805C103K5RAC-TU-Kemet-datasheet-5313836.pdf?src-supplier=Farnell; ComponentLink15URL: https://datasheet.octopart.com:443/C0805C103K5RAC-TU-Kemet-datasheet-8111010.pdf?src-supplier=Farnell; ComponentLink15Description: https://datasheet.octopart.com:443/C0805C103K5RAC-TU-Kemet-datasheet-8111010.pdf?src-supplier=Farnell; ComponentLink16URL: https://datasheet.octopart.com:443/C0805C103K5RAC-TU-Kemet-datasheet-7627733.pdf?src-supplier=Farnell; ComponentLink16Description: https://datasheet.octopart.com:443/C0805C103K5RAC-TU-Kemet-datasheet-7627733.pdf?src-supplier=Farnell; ComponentLink17URL: https://datasheet.octopart.com:443/C0805C103K5RACTU-Kemet-datasheet-500041.pdf?src-supplier=Farnell; ComponentLink17Description: https://datasheet.octopart.com:443/C0805C103K5RACTU-Kemet-datasheet-500041.pdf?src-supplier=Farnell; ComponentLink18URL: https://datasheet.octopart.com:443/C0805C103K5RAC-TU-Kemet-datasheet-5315946.pdf?src-supplier=Farnell; ComponentLink18Description: https://datasheet.octopart.com:443/C0805C103K5RAC-TU-Kemet-datasheet-5315946.pdf?src-supplier=Farnell; ComponentLink19URL: https://datasheet.octopart.com:443/C0805C103K5RACTU-KEMET-datasheet-182041101.pdf?src-supplier=IHS; ComponentLink19Description: https://datasheet.octopart.com:443/C0805C103K5RACTU-KEMET-datasheet-182041101.pdf?src-supplier=IHS; ComponentLink20URL: https://datasheet.octopart.com:443/C0805C103K5RACTU-KEMET-datasheet-68331921.pdf?src-supplier=Upverter; ComponentLink20Description: https://datasheet.octopart.com:443/C0805C103K5RACTU-KEMET-datasheet-68331921.pdf?src-supplier=Upverter; ComponentLink21URL: https://datasheet.octopart.com:443/C0805C103K5RAC-TU-Kemet-datasheet-5313890.pdf?src-supplier=Newark; ComponentLink21Description: https://datasheet.octopart.com:443/C0805C103K5RAC-TU-Kemet-datasheet-5313890.pdf?src-supplier=Newark; ComponentLink22URL: https://datasheet.octopart.com:443/C0805C103K5RACTU-KEMET-datasheet-130256537.pdf?src-supplier=Newark; ComponentLink22Description: https://datasheet.octopart.com:443/C0805C103K5RACTU-KEMET-datasheet-130256537.pdf?src-supplier=Newark; ComponentLink23URL: https://datasheet.octopart.com:443/C0805C103K5RAC-TU-Kemet-datasheet-5390537.pdf?src-supplier=Newark; ComponentLink23Description: https://datasheet.octopart.com:443/C0805C103K5RAC-TU-Kemet-datasheet-5390537.pdf?src-supplier=Newark; ComponentLink24URL: https://datasheet.octopart.com:443/C0805C103K5RAC-TU-Kemet-datasheet-7541751.pdf?src-supplier=Newark; ComponentLink24Description: https://datasheet.octopart.com:443/C0805C103K5RAC-TU-Kemet-datasheet-7541751.pdf?src-supplier=Newark; ComponentLink25URL: https://datasheet.octopart.com:443/C0805C103K5RACTU-KEMET-datasheet-176142293.pdf?src-supplier=Newark; ComponentLink25Description: https://datasheet.octopart.com:443/C0805C103K5RACTU-KEMET-datasheet-176142293.pdf?src-supplier=Newark; ComponentLink26URL: https://datasheet.octopart.com:443/C0805C103K5RACTU-Kemet-datasheet-27203261.pdf?src-supplier=Newark; ComponentLink26Description: https://datasheet.octopart.com:443/C0805C103K5RACTU-Kemet-datasheet-27203261.pdf?src-supplier=Newark; ComponentLink27URL: https://datasheet.octopart.com:443/C0805C103K5RACTU-Kemet-datasheet-8764837.pdf?src-supplier=Newark; ComponentLink27Description: https://datasheet.octopart.com:443/C0805C103K5RACTU-Kemet-datasheet-8764837.pdf?src-supplier=Newark; ComponentLink28URL: https://datasheet.octopart.com:443/C0805C103K5RACTU-Kemet-datasheet-8480123.pdf?src-supplier=Newark; ComponentLink28Description: https://datasheet.octopart.com:443/C0805C103K5RACTU-Kemet-datasheet-8480123.pdf?src-supplier=Newark; ComponentLink29URL: https://datasheet.octopart.com:443/C0805C103K5RACTU-Kemet-datasheet-5393970.pdf?src-supplier=Newark; ComponentLink29Description: https://datasheet.octopart.com:443/C0805C103K5RACTU-Kemet-datasheet-5393970.pdf?src-supplier=Newark; ComponentLink30URL: https://datasheet.octopart.com:443/C0805C103K5RACTU-Kemet-datasheet-8502025.pdf?src-supplier=Newark; ComponentLink30Description: https://datasheet.octopart.com:443/C0805C103K5RACTU-Kemet-datasheet-8502025.pdf?src-supplier=Newark; ComponentLink31URL: https://datasheet.octopart.com:443/C0805C103K5RACTU-Kemet-datasheet-161801.pdf?src-supplier=Newark; ComponentLink31Description: https://datasheet.octopart.com:443/C0805C103K5RACTU-Kemet-datasheet-161801.pdf?src-supplier=Newark; ComponentLink32URL: https://datasheet.octopart.com:443/C0805C103K5RAC7800-KEMET-datasheet-37550250.pdf?src-supplier=Electro+Sonic; ComponentLink32Description: https://datasheet.octopart.com:443/C0805C103K5RAC7800-KEMET-datasheet-37550250.pdf?src-supplier=Electro+Sonic; ComponentLink33URL: https://datasheet.octopart.com:443/C0805C103K5RACTU-KEMET-datasheet-32036385.pdf?src-supplier=Electro+Sonic; ComponentLink33Description: https://datasheet.octopart.com:443/C0805C103K5RACTU-KEMET-datasheet-32036385.pdf?src-supplier=Electro+Sonic; ComponentLink34URL: https://datasheet.octopart.com:443/C0805C103K5RAC7800-KEMET-datasheet-188512054.pdf?src-supplier=ODG+(Origin+Data+Global); ComponentLink34Description: https://datasheet.octopart.com:443/C0805C103K5RAC7800-KEMET-datasheet-188512054.pdf?src-supplier=ODG+(Origin+Data+Global); ComponentLink35URL: https://datasheet.octopart.com:443/C0805C103K5RACTU-KEMET-datasheet-178249621.pdf?src-supplier=Master+Electronics; ComponentLink35Description: https://datasheet.octopart.com:443/C0805C103K5RACTU-KEMET-datasheet-178249621.pdf?src-supplier=Master+Electronics; ComponentLink36URL: https://datasheet.octopart.com:443/C0805C103K5RACTU-KEMET-datasheet-164512540.pdf?src-supplier=TME; ComponentLink36Description: https://datasheet.octopart.com:443/C0805C103K5RACTU-KEMET-datasheet-164512540.pdf?src-supplier=TME; ComponentLink37URL: https://datasheet.octopart.com:443/C0805C103K5RACTU-KEMET-datasheet-67847103.pdf?src-supplier=TME; ComponentLink37Description: https://datasheet.octopart.com:443/C0805C103K5RACTU-KEMET-datasheet-67847103.pdf?src-supplier=TME; ComponentLink38URL: https://datasheet.octopart.com:443/C0805C103K5RACTU-KEMET-datasheet-68331906.pdf?src-supplier=TME; ComponentLink38Description: https://datasheet.octopart.com:443/C0805C103K5RACTU-KEMET-datasheet-68331906.pdf?src-supplier=TME; ComponentLink39URL: https://datasheet.octopart.com:443/C0805C103K5RACTU-KEMET-datasheet-110724412.pdf?src-supplier=RS+(Formerly+Allied+Electronics); ComponentLink39Description: https://datasheet.octopart.com:443/C0805C103K5RACTU-KEMET-datasheet-110724412.pdf?src-supplier=RS+(Formerly+Allied+Electronics); ComponentLink40URL: https://datasheet.octopart.com:443/C0805C103K5RACTU-Kemet-datasheet-464.pdf?src-supplier=RS+(Formerly+Allied+Electronics); ComponentLink40Description: https://datasheet.octopart.com:443/C0805C103K5RACTU-Kemet-datasheet-464.pdf?src-supplier=RS+(Formerly+Allied+Electronics); ComponentLink41URL: https://datasheet.octopart.com/C0805C103K5RACTU-KEMET-datasheet-84169754.pdf; ComponentLink41Description: https://datasheet.octopart.com/C0805C103K5RACTU-KEMET-datasheet-84169754.pdf; ComponentLink42URL: https://datasheet.octopart.com:443/C0805C103K5RACTU-Kemet-datasheet-24570007.pdf?src-supplier=element14+APAC; ComponentLink42Description: https://datasheet.octopart.com:443/C0805C103K5RACTU-Kemet-datasheet-24570007.pdf?src-supplier=element14+APAC; ComponentLink43URL: https://datasheet.octopart.com:443/C0805C103K5RACTU-Kemet-datasheet-22084244.pdf?src-supplier=element14+APAC; ComponentLink43Description: https://datasheet.octopart.com:443/C0805C103K5RACTU-Kemet-datasheet-22084244.pdf?src-supplier=element14+APAC; ComponentLink44URL: https://datasheet.octopart.com:443/C0805C103K5RACTU-Kemet-datasheet-11974838.pdf?src-supplier=Arrow+Electronics; ComponentLink44Description: https://datasheet.octopart.com:443/C0805C103K5RACTU-Kemet-datasheet-11974838.pdf?src-supplier=Arrow+Electronics; ComponentLink45URL: http://sigma.octopart.com:80/conflict_mineral_statement/Yageo-company-3.pdf?src-supplier=Compliance+Statements; ComponentLink45Description: http://sigma.octopart.com:80/conflict_mineral_statement/Yageo-company-3.pdf?src-supplier=Compliance+Statements; ComponentLink46URL: http://sigma.octopart.com:80/rohs_statement/Yageo-company-2.pdf?src-supplier=Compliance+Statements; ComponentLink46Description: http://sigma.octopart.com:80/rohs_statement/Yageo-company-2.pdf?src-supplier=Compliance+Statements
J1-J6 = PAD_WITH_HOLE_4MM_1MM5: pad with a hole 4mm x 1.5mm
L1 = DR125-3R3-R: Inductor Power Shielded Drum Core 3.3uH 20% 100KHz Ferrite 9.26A 6.3mOhm DCR T/R; Manufacturer: Eaton; DC Resistance (DCR): 6.3mΩ; Value: 3.3µH; Number of Circuits: 1; Saturation Current: 12.7A; Supplier: DigiKey; Supplier Part Number: 513-1529-1-ND; Manufacturer Part Number: DR125-3R3-R; RoHS: Compliant; Category: Fixed Inductors; Stock: 12331; Pricing: 1=0.98, 10=0.803, 100=0.6606 (USD); Case/Package: 0125; Composition: Wirewound; Core Material: Ferrite; Country of Origin: Philippines; Current Rating: 9.26A; Depth: 12.5mm; Export Control Classification Number (ECCN) Code: EAR99; Height: 6mm; Height - Seated (Max): 5.9944mm; Harmonized Tariff Schedule (HTS) Code: 8504.50.80.00; Inductance Tolerance: 20%; Introduction Date: 2005-07-20; Lead Free: Lead Free; Length: 12.5mm; Lifecycle Status: Production; Max Current Rating: 9.26A; Max DC Current: 9.26A; Max Operating Temperature: 125°C; Military Standard: Not; Min Operating Temperature: -40°C; Mounting Technology: Surface Mount; Pins: 2; Number of Terminals: 2; Radiation Hardening: No; REACH SVHC: No; RMS Current (Irms): 9.26A; Schedule B: 8504500000, 8504500000|8504500000|8504500000|8504500000|8504500000|8504500000|8504500000|8504500000|8504500000|8504500000|8504500000|8504500000|8504500000|8504500000|8504500000|8504500000|8504500000|8504500000|8504500000|8504500000|8504500000|8504500000|8504500000|85; Self Resonant Frequency: 100kHz; Shielding: Shielded; Termination: SMD/SMT; Test Frequency: 100kHz; Tolerance: 20%; Weight: 4.082331g; Width: 12.5mm; ComponentLink1URL: https://datasheet.octopart.com:443/DR125-3R3-R-Eaton-datasheet-129252529.pdf?src-supplier=Electro+Sonic; ComponentLink1Description: https://datasheet.octopart.com:443/DR125-3R3-R-Eaton-datasheet-129252529.pdf?src-supplier=Electro+Sonic; ComponentLink2URL: https://datasheet.octopart.com:443/DR125-3R3-R-Eaton-datasheet-41175520.pdf?src-supplier=Master+Electronics; ComponentLink2Description: https://datasheet.octopart.com:443/DR125-3R3-R-Eaton-datasheet-41175520.pdf?src-supplier=Master+Electronics; ComponentLink3URL: https://datasheet.octopart.com:443/DR125-3R3-R-Coiltronics-datasheet-8612520.pdf?src-supplier=IHS; ComponentLink3Description: https://datasheet.octopart.com:443/DR125-3R3-R-Coiltronics-datasheet-8612520.pdf?src-supplier=IHS; ComponentLink4URL: https://datasheet.octopart.com:443/DR125-3R3-R-Eaton-datasheet-552538.pdf?src-supplier=Newark; ComponentLink4Description: https://datasheet.octopart.com:443/DR125-3R3-R-Eaton-datasheet-552538.pdf?src-supplier=Newark; ComponentLink5URL: https://datasheet.octopart.com:443/DR125-3R3-R-Coiltronics-datasheet-3395.pdf?src-supplier=Factory+Futures; ComponentLink5Description: https://datasheet.octopart.com:443/DR125-3R3-R-Coiltronics-datasheet-3395.pdf?src-supplier=Factory+Futures; ComponentLink6URL: https://datasheet.octopart.com:443/DR125-3R3-R-Eaton-datasheet-37490916.pdf?src-supplier=RS+(Formerly+Allied+Electronics); ComponentLink6Description: https://datasheet.octopart.com:443/DR125-3R3-R-Eaton-datasheet-37490916.pdf?src-supplier=RS+(Formerly+Allied+Electronics); ComponentLink7URL: https://datasheet.octopart.com:443/DR125-3R3-R-Coiltronics-datasheet-119352.pdf?src-supplier=DigiKey; ComponentLink7Description: https://datasheet.octopart.com:443/DR125-3R3-R-Coiltronics-datasheet-119352.pdf?src-supplier=DigiKey